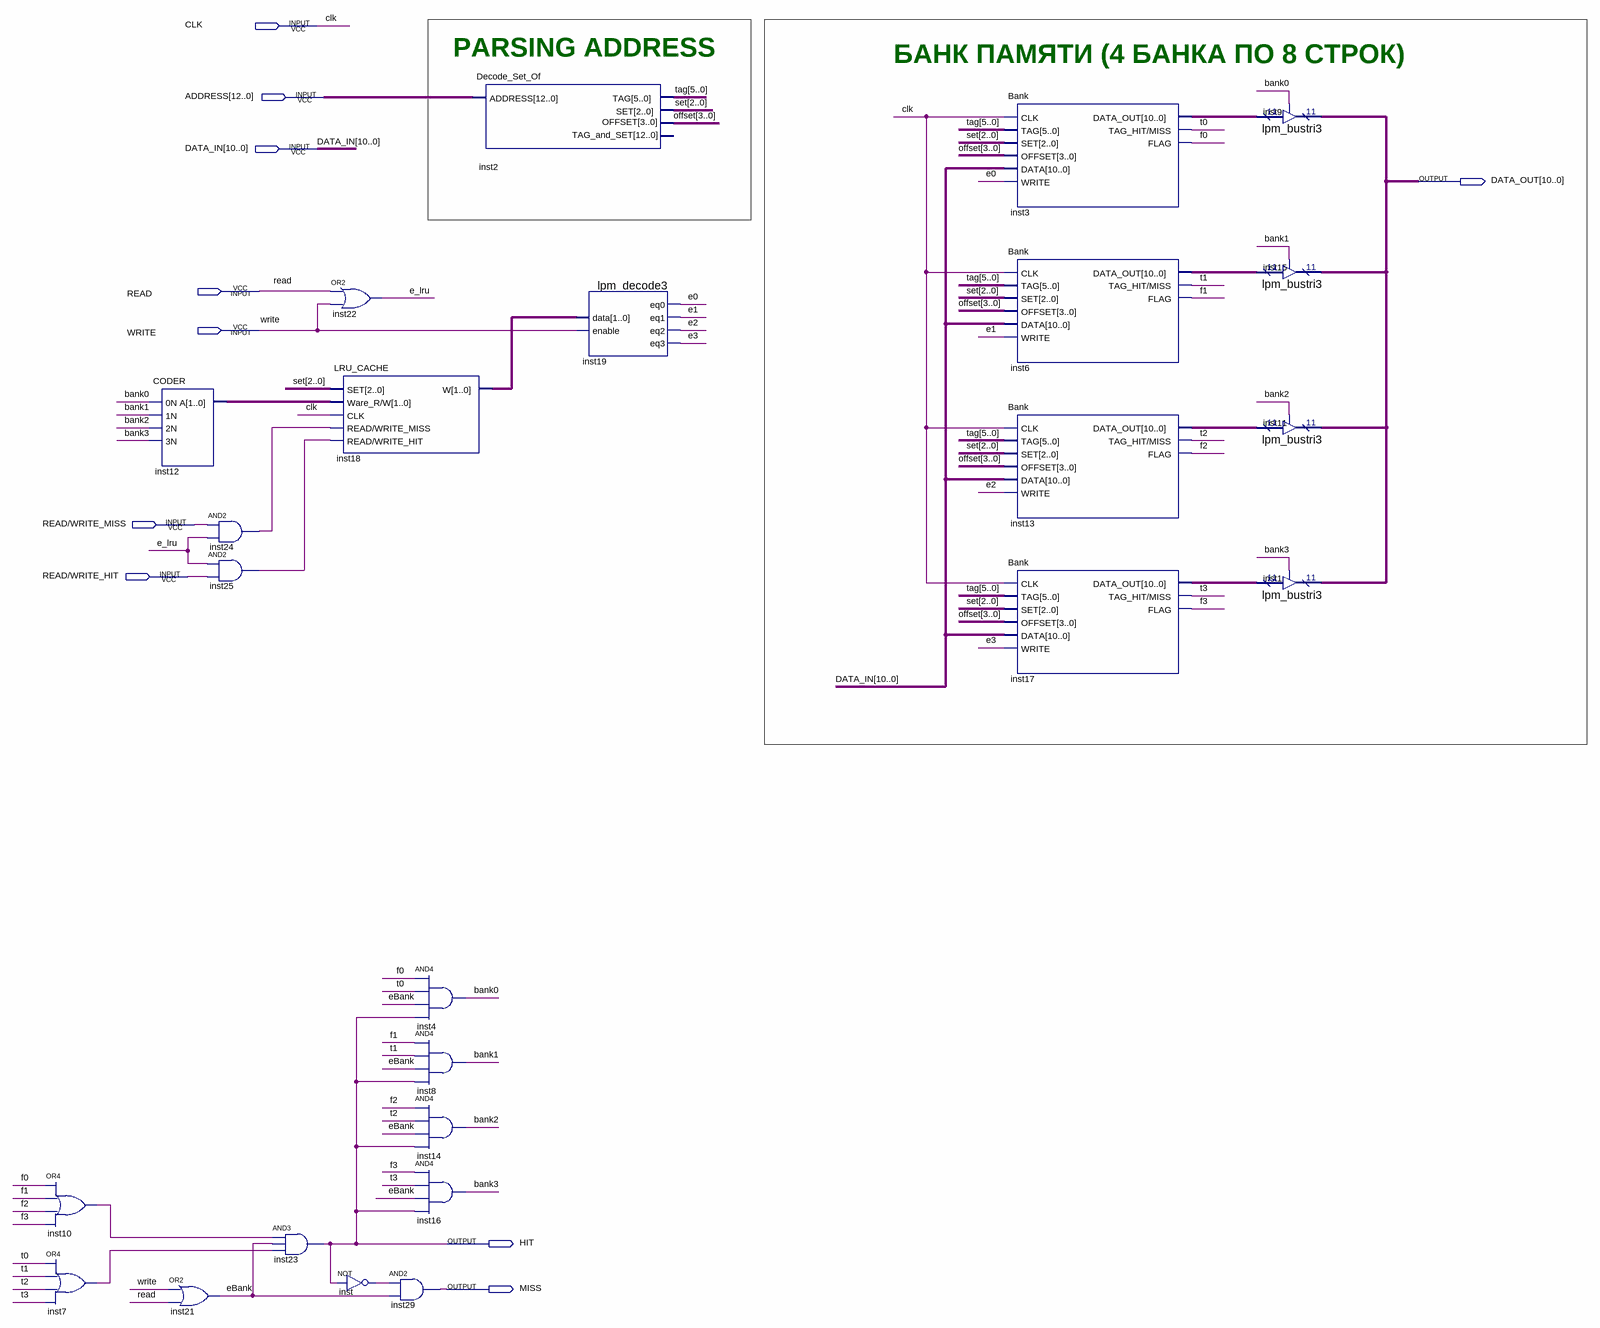
[diagram p0: schematic sheet]
// Quartus schematic Banks_Memory.bdf as structural Verilog: 25 symbols, 10 pins
module Banks_Memory (
  input  CLK,
  input  [12:0] ADDRESS,
  input  [10:0] DATA_IN,
  input  READ,
  input  WRITE,
  input  \READ/WRITE_MISS ,
  input  \READ/WRITE_HIT ,
  output [10:0] DATA_OUT,
  output HIT,
  output MISS
);

  wire bank0, bank1, bank2, bank3, e0, e1, e2, e3, e_lru, eBank, f0, f1, f2, f3, inst7_out, inst10_out,
       inst24_out, inst25_out, inst_out, t0, t1, t2, t3;
  wire [1:0] inst12_a, inst18_w;
  wire [2:0] set;
  wire [3:0] offset;
  wire [5:0] tag;
  wire [10:0] inst3_data_out, inst6_data_out, inst13_data_out, inst17_data_out;

  or inst10 (inst10_out, f0, f1, f2, f3);
  or inst7 (inst7_out, t0, t1, t2, t3);
  CODER inst12 (.\0N (bank0), .\1N (bank1), .\2N (bank2), .\3N (bank3), .A(inst12_a));
  or inst21 (eBank, WRITE, READ);
  and inst24 (inst24_out, \READ/WRITE_MISS , e_lru);
  and inst25 (inst25_out, e_lru, \READ/WRITE_HIT );
  and inst23 (HIT, inst10_out, eBank, inst7_out);
  or inst22 (e_lru, READ, WRITE);
  LRU_CACHE inst18 (
    .SET(set), .\Ware_R/W (inst12_a), .CLK(CLK), .\READ/WRITE_MISS (inst24_out),
    .\READ/WRITE_HIT (inst25_out), .W(inst18_w));
  not inst (inst_out, HIT);
  and inst4 (bank0, f0, t0, eBank, HIT);
  and inst8 (bank1, f1, t1, eBank, HIT);
  and inst14 (bank2, f2, t2, eBank, HIT);
  and inst16 (bank3, f3, t3, eBank, HIT);
  and inst29 (MISS, inst_out, eBank);
  Decode_Set_Of inst2 (.ADDRESS(ADDRESS), .TAG(tag), .SET(set), .OFFSET(offset));  // open: TAG_and_SET
  lpm_decode3 inst19 (.data(inst18_w), .enable(WRITE), .eq0(e0), .eq1(e1), .eq2(e2), .eq3(e3));
  Bank inst3 (
    .CLK(CLK), .TAG(tag), .SET(set), .OFFSET(offset), .DATA(DATA_IN), .WRITE(e0), .DATA_OUT(inst3_data_out),
    .\TAG_HIT/MISS (t0), .FLAG(f0));
  Bank inst6 (
    .CLK(CLK), .TAG(tag), .SET(set), .OFFSET(offset), .DATA(DATA_IN), .WRITE(e1), .DATA_OUT(inst6_data_out),
    .\TAG_HIT/MISS (t1), .FLAG(f1));
  Bank inst13 (
    .CLK(CLK), .TAG(tag), .SET(set), .OFFSET(offset), .DATA(DATA_IN), .WRITE(e2), .DATA_OUT(inst13_data_out),
    .\TAG_HIT/MISS (t2), .FLAG(f2));
  Bank inst17 (
    .CLK(CLK), .TAG(tag), .SET(set), .OFFSET(offset), .DATA(DATA_IN), .WRITE(e3), .DATA_OUT(inst17_data_out),
    .\TAG_HIT/MISS (t3), .FLAG(f3));
  lpm_bustri3 inst9 (.enabledt(bank0), .data(inst3_data_out), .tridata(DATA_OUT));
  lpm_bustri3 inst15 (.enabledt(bank1), .data(inst6_data_out), .tridata(DATA_OUT));
  lpm_bustri3 inst11 (.enabledt(bank2), .data(inst13_data_out), .tridata(DATA_OUT));
  lpm_bustri3 inst1 (.enabledt(bank3), .data(inst17_data_out), .tridata(DATA_OUT));

  // Notes on the sheet:
  //   PARSING ADDRESS
  //   БАНК ПАМЯТИ (4 БАНКА ПО 8 СТРОК)
endmodule
